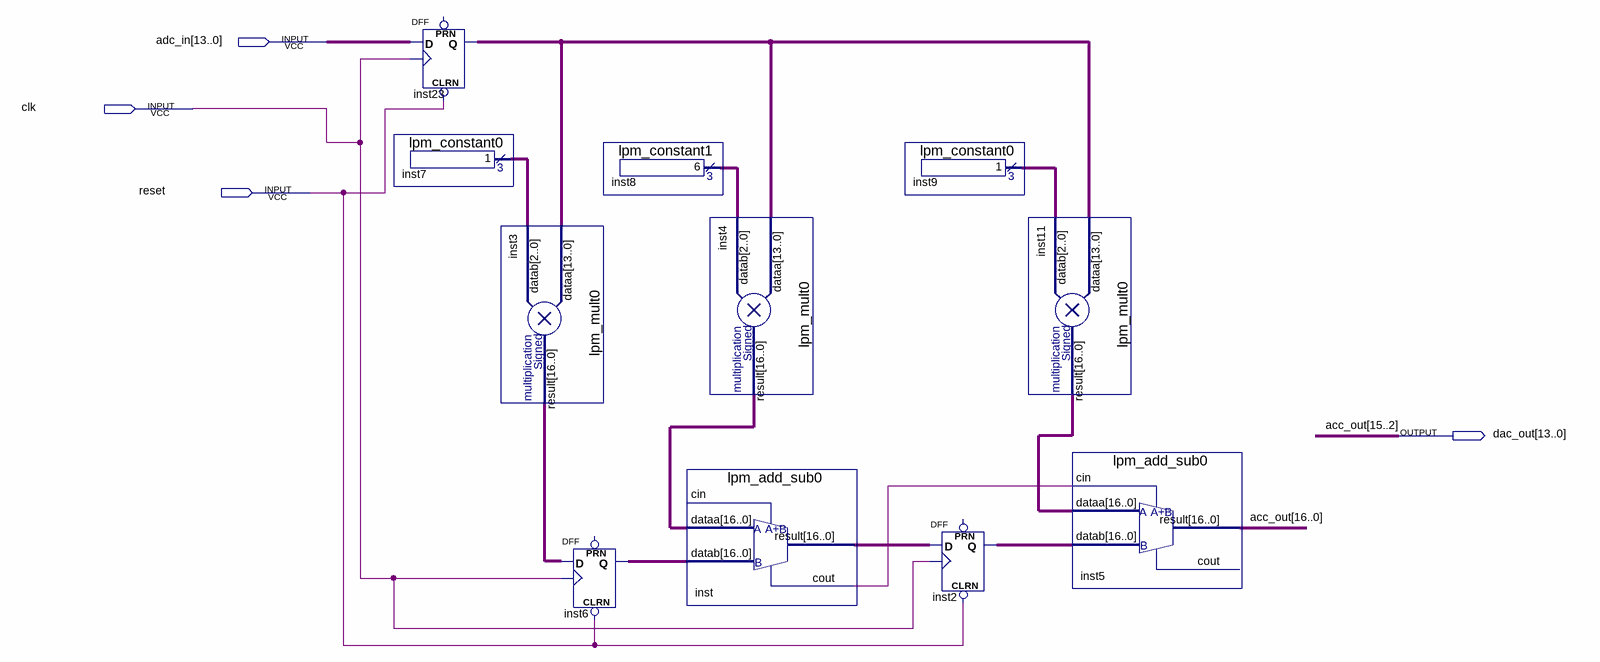
[diagram p0: schematic sheet]
// Quartus schematic hochpass.bdf as structural Verilog: 11 symbols, 4 pins
module hochpass (
  input  [13:0] adc_in,
  input  clk,
  input  reset,
  output [13:0] dac_out
);

  wire inst_cout;
  wire [2:0] inst7_result, inst8_result, inst9_result;
  wire [13:0] inst23_q;
  wire [16:0] acc_out, inst2_q, inst3_result, inst4_result, inst6_q, inst11_result, inst_result;

  DFF inst23[13:0] (.CLRN(reset), .CLK(clk), .D(adc_in), .Q(inst23_q));  // open: PRN
  lpm_constant0 inst7 (.result(inst7_result));
  lpm_mult0 inst3 (.dataa(inst23_q), .datab(inst7_result), .result(inst3_result));
  lpm_constant1 inst8 (.result(inst8_result));
  DFF inst6[16:0] (.CLRN(reset), .CLK(clk), .D(inst3_result), .Q(inst6_q));  // open: PRN
  lpm_mult0 inst4 (.dataa(inst23_q), .datab(inst8_result), .result(inst4_result));
  lpm_add_sub0 inst (.dataa(inst4_result), .datab(inst6_q), .result(inst_result), .cout(inst_cout));  // open: cin
  lpm_constant0 inst9 (.result(inst9_result));
  DFF inst2[16:0] (.CLRN(reset), .CLK(clk), .D(inst_result), .Q(inst2_q));  // open: PRN
  lpm_mult0 inst11 (.dataa(inst23_q), .datab(inst9_result), .result(inst11_result));
  lpm_add_sub0 inst5 (
    .cin(inst_cout), .dataa(inst11_result), .datab(inst2_q), .result({acc_out[16], dac_out, acc_out[1:0]}));  // open: cout

  // Other names for the same wires on the sheet: acc_out[15:2] = dac_out
endmodule
